# Altium schematic sheet XMOS_TSBOARD_IV.SchDoc
size A4; DocumentNumber: 8; SheetNumber: 8; SheetTotal: 8
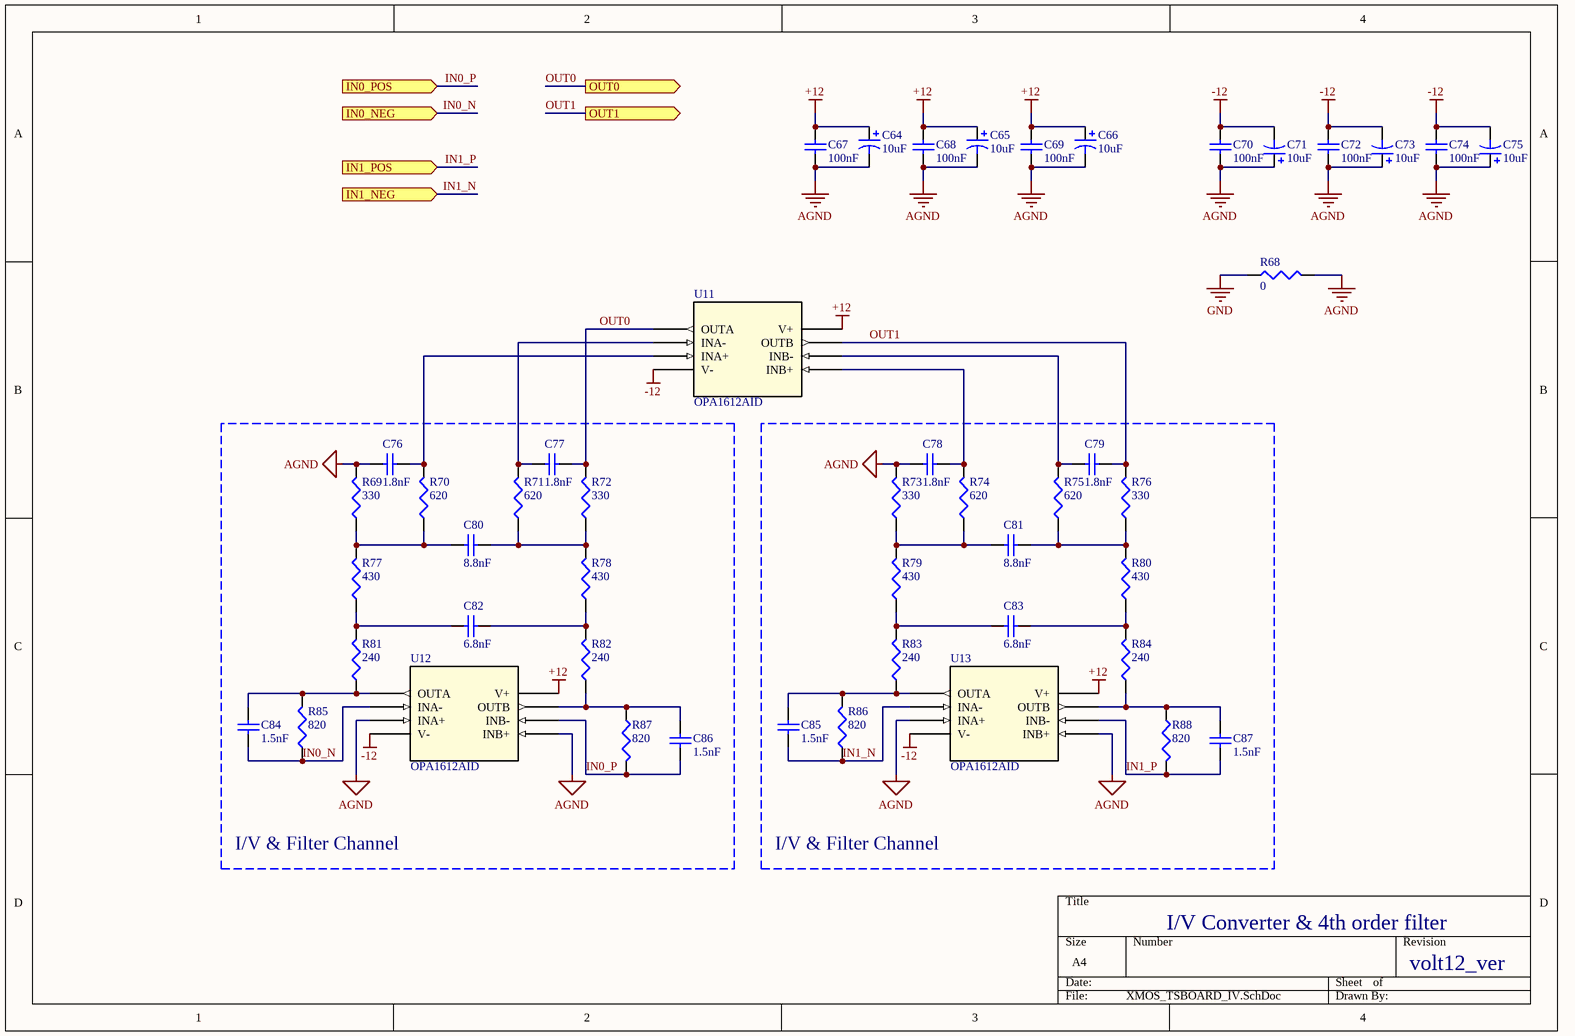
[diagram p0: XMOS_TSBOARD_IV.SchDoc]

## Parts
C64  value 10uF  [C0805]  (hidden comment: Cap Pol3)
C65  value 10uF  [C0805]  (hidden comment: Cap Pol3)
C66  value 10uF  [C0805]  (hidden comment: Cap Pol3)
C67  value 100nF  [1608[0603]]  (hidden comment: Cap Semi)
C68  value 100nF  [1608[0603]]  (hidden comment: Cap Semi)
C69  value 100nF  [1608[0603]]  (hidden comment: Cap Semi)
C70  value 100nF  [1608[0603]]  (hidden comment: Cap Semi)
C71  value 10uF  [C0805]  (hidden comment: Cap Pol3)
C72  value 100nF  [1608[0603]]  (hidden comment: Cap Semi)
C73  value 10uF  [C0805]  (hidden comment: Cap Pol3)
C74  value 100nF  [1608[0603]]  (hidden comment: Cap Semi)
C75  value 10uF  [C0805]  (hidden comment: Cap Pol3)
C76  value 1.8nF  [1608[0603]]  (hidden comment: Cap Semi)
C77  value 1.8nF  [1608[0603]]  (hidden comment: Cap Semi)
C78  value 1.8nF  [1608[0603]]  (hidden comment: Cap Semi)
C79  value 1.8nF  [1608[0603]]  (hidden comment: Cap Semi)
C80  value 8.8nF  [1608[0603]]  (hidden comment: Cap Semi)
C81  value 8.8nF  [1608[0603]]  (hidden comment: Cap Semi)
C82  value 6.8nF  [1608[0603]]  (hidden comment: Cap Semi)
C83  value 6.8nF  [1608[0603]]  (hidden comment: Cap Semi)
C84  value 1.5nF  [1608[0603]]  (hidden comment: Cap Semi)
C85  value 1.5nF  [1608[0603]]  (hidden comment: Cap Semi)
C86  value 1.5nF  [1608[0603]]  (hidden comment: Cap Semi)
C87  value 1.5nF  [1608[0603]]  (hidden comment: Cap Semi)
R68  value 0  [J1-0603]  (hidden comment: Res3)
R69  value 330  [J1-0603]  (hidden comment: Res3)
R70  value 620  [J1-0603]  (hidden comment: Res3)
R71  value 620  [J1-0603]  (hidden comment: Res3)
R72  value 330  [J1-0603]  (hidden comment: Res3)
R73  value 330  [J1-0603]  (hidden comment: Res3)
R74  value 620  [J1-0603]  (hidden comment: Res3)
R75  value 620  [J1-0603]  (hidden comment: Res3)
R76  value 330  [J1-0603]  (hidden comment: Res3)
R77  value 430  [J1-0603]  (hidden comment: Res3)
R78  value 430  [J1-0603]  (hidden comment: Res3)
R79  value 430  [J1-0603]  (hidden comment: Res3)
R80  value 430  [J1-0603]  (hidden comment: Res3)
R81  value 240  [J1-0603]  (hidden comment: Res3)
R82  value 240  [J1-0603]  (hidden comment: Res3)
R83  value 240  [J1-0603]  (hidden comment: Res3)
R84  value 240  [J1-0603]  (hidden comment: Res3)
R85  value 820  [J1-0603]  (hidden comment: Res3)
R86  value 820  [J1-0603]  (hidden comment: Res3)
R87  value 820  [J1-0603]  (hidden comment: Res3)
R88  value 820  [J1-0603]  (hidden comment: Res3)
U11  OPA1612AID  [D8]
U12  OPA1612AID  [D8]
U13  OPA1612AID  [D8]

## Blocks framed on the sheet
I/V & Filter Channel: C76 C77 C80 C82 C84 C86 R69-R72 R77 R78 R81 R82 R85 R87 U12
I/V & Filter Channel: C78 C79 C81 C83 C85 C87 R73-R76 R79 R80 R83 R84 R86 R88 U13

## Ports
IN0_NEG (in), IN0_POS (in), IN1_NEG (in), IN1_POS (in), OUT0 (out), OUT1 (out)

## Nets
+12: C64.1 C65.1 C66.1 C67.2 C68.2 C69.2 U11.8(V+) U12.8(V+) U13.8(V+)
-12: C70.2 C71.2 C72.2 C73.2 C74.2 C75.2 U11.4(V-) U12.4(V-) U13.4(V-)
AGND: C64.2 C65.2 C66.2 C67.1 C68.1 C69.1 C70.1 C71.1 C72.1 C73.1 C74.1 C75.1 C76.2 C78.2 R68.2 R69.2 R73.2 U12.3(INA+) U12.5(INB+) U13.3(INA+) U13.5(INB+)
GND: R68.1
IN0_N: C84.1 R85.1 U12.2(INA-) ; port IN0_NEG
IN0_P: C86.2 R87.2 U12.6(INB-) ; port IN0_POS
IN1_N: C85.1 R86.1 U13.2(INA-) ; port IN1_NEG
IN1_P: C87.2 R88.2 U13.6(INB-) ; port IN1_POS
OUT0: C77.1 R72.2 U11.1(OUTA) ; port OUT0
OUT1: C79.1 R76.2 U11.7(OUTB) ; port OUT1
NetC76_1: C76.1 R70.2 U11.3(INA+)
NetC77_2: C77.2 R71.2 U11.2(INA-)
NetC78_1: C78.1 R74.2 U11.5(INB+)
NetC79_2: C79.2 R75.2 U11.6(INB-)
NetC80_1: C80.1 R71.1 R72.1 R78.2
NetC80_2: C80.2 R69.1 R70.1 R77.2
NetC81_1: C81.1 R75.1 R76.1 R80.2
NetC81_2: C81.2 R73.1 R74.1 R79.2
NetC82_1: C82.1 R78.1 R82.2
NetC82_2: C82.2 R77.1 R81.2
NetC83_1: C83.1 R80.1 R84.2
NetC83_2: C83.2 R79.1 R83.2
NetC84_2: C84.2 R81.1 R85.2 U12.1(OUTA)
NetC85_2: C85.2 R83.1 R86.2 U13.1(OUTA)
NetC86_1: C86.1 R82.1 R87.1 U12.7(OUTB)
NetC87_1: C87.1 R84.1 R88.1 U13.7(OUTB)

## Notes on the sheet
- I/V Converter & 4th order filter
- volt12_ver

## Library data of the parts
C64-C66 C71 C73 C75 = Cap Pol3: Polarized Capacitor (Surface Mount); Published: 8-Jun-2000; LatestRevisionDate: 29-May-2009; LatestRevisionNote: IPC-7351 Footprint Added.; PackageReference: C0805; Publisher: Altium Limited; PackageDescription: Chip Capacitor
C67-C70 C72 C74 C76-C87 = Cap Semi: Capacitor (Semiconductor SIM Model); Published: 8-Jun-2000; LatestRevisionDate: 29-May-2009; LatestRevisionNote: IPC-7351 Footprint Added.; PackageReference: C1206; Publisher: Altium Limited; PackageDescription: Chip Capacitor
R68-R88 = Res3: Resistor; Published: 8-Jun-2000; LatestRevisionDate: 29-May-2009; LatestRevisionNote: IPC-7351 Footprint Added.; PackageReference: J1-0603; Publisher: Altium Limited; PackageDescription: Chip Resistor
U11-U13 = OPA1612AID: SoundPlus High-Performance, Bipolar-Input Audio Operational Amplifiers